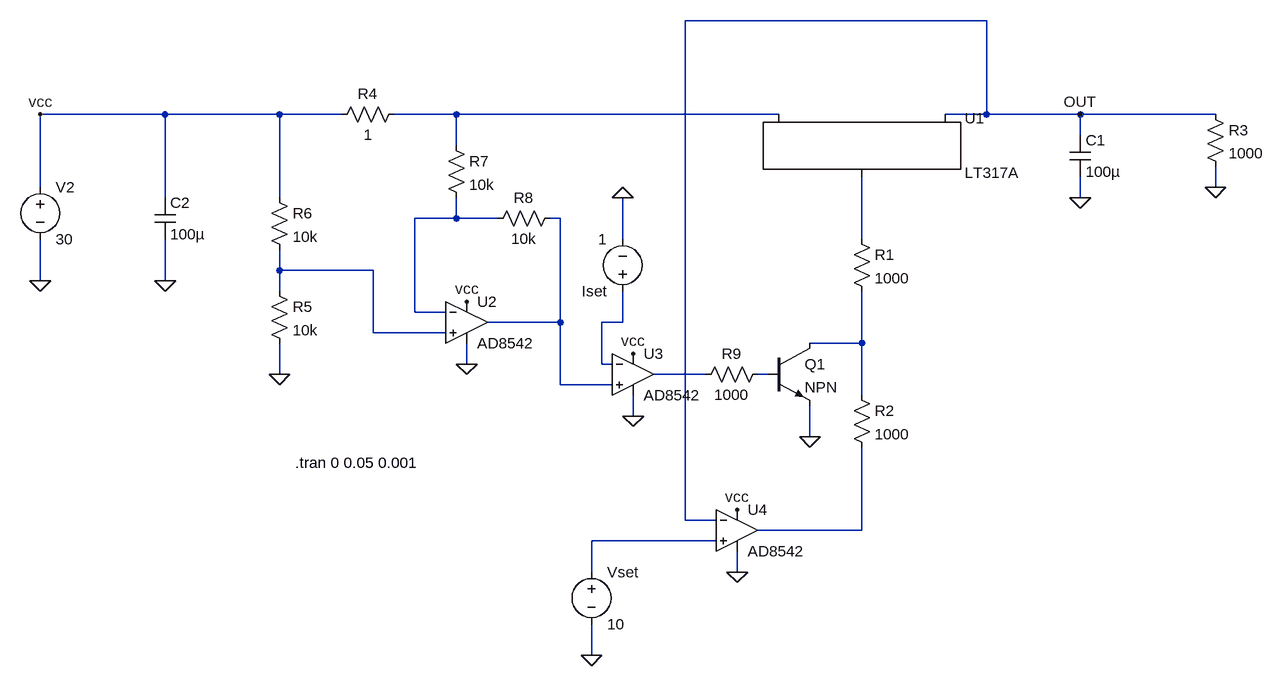
[diagram p0: schematic Draft1.asc]
Draft1.asc, the LTspice schematic file:
Version 4
SHEET 1 888 996
WIRE 416 0 -48 0
WIRE -848 144 -1040 144
WIRE -672 144 -848 144
WIRE -576 144 -672 144
WIRE -400 144 -496 144
WIRE 96 144 -400 144
WIRE 416 144 416 0
WIRE 416 144 352 144
WIRE 560 144 416 144
WIRE 768 144 560 144
WIRE 560 176 560 144
WIRE -400 192 -400 144
WIRE -1040 256 -1040 144
WIRE 768 256 768 224
WIRE -848 272 -848 144
WIRE -672 272 -672 144
WIRE 560 272 560 240
WIRE -400 304 -400 272
WIRE -400 304 -464 304
WIRE -336 304 -400 304
WIRE -240 304 -256 304
WIRE -144 336 -144 272
WIRE 224 336 224 240
WIRE -672 384 -672 352
WIRE -528 384 -672 384
WIRE -1040 400 -1040 336
WIRE -848 400 -848 336
WIRE -672 416 -672 384
WIRE -464 448 -464 304
WIRE -416 448 -464 448
WIRE -240 464 -240 304
WIRE -240 464 -352 464
WIRE -144 464 -144 416
WIRE -144 464 -176 464
WIRE -528 480 -528 384
WIRE -416 480 -528 480
WIRE 224 496 224 416
WIRE 224 496 144 496
WIRE -384 528 -384 496
WIRE -176 528 -176 464
WIRE -160 528 -176 528
WIRE -672 544 -672 496
WIRE -16 544 -96 544
WIRE 80 544 64 544
WIRE -240 560 -240 464
WIRE -160 560 -240 560
WIRE 224 576 224 496
WIRE -128 608 -128 576
WIRE 144 640 144 592
WIRE -48 768 -48 0
WIRE 0 768 -48 768
WIRE 224 784 224 656
WIRE 224 784 64 784
WIRE 0 800 -192 800
WIRE -192 848 -192 800
WIRE 32 848 32 816
WIRE -192 976 -192 928
FLAG 560 272 0
FLAG -1040 400 0
FLAG 768 256 0
FLAG 560 144 OUT
FLAG -848 400 0
FLAG -672 544 0
FLAG -1040 144 vcc
FLAG -384 432 vcc
FLAG -384 528 0
FLAG 144 640 0
FLAG -128 512 vcc
FLAG -128 608 0
FLAG 32 752 vcc
FLAG 32 848 0
FLAG -144 272 0
FLAG -192 976 0
SYMBOL cap 544 176 R0
SYMATTR InstName C1
SYMATTR Value 100µ
SYMBOL voltage -1040 240 R0
WINDOW 123 0 0 Left 0
WINDOW 39 0 0 Left 0
SYMATTR InstName V2
SYMATTR Value 30
SYMBOL res 752 128 R0
SYMATTR InstName R3
SYMATTR Value 1000
SYMBOL PowerProducts\\LT317A 224 144 R0
SYMATTR InstName U1
SYMBOL OpAmps\\AD8542 32 720 R0
SYMATTR InstName U4
SYMBOL res 208 320 R0
SYMATTR InstName R1
SYMATTR Value 1000
SYMBOL res 208 560 R0
SYMATTR InstName R2
SYMATTR Value 1000
SYMBOL res -480 128 R90
WINDOW 0 0 56 VBottom 2
WINDOW 3 32 56 VTop 2
SYMATTR InstName R4
SYMATTR Value 1
SYMBOL cap -864 272 R0
SYMATTR InstName C2
SYMATTR Value 100µ
SYMBOL OpAmps\\AD8542 -384 400 R0
SYMATTR InstName U2
SYMBOL res -688 400 R0
SYMATTR InstName R5
SYMATTR Value 10k
SYMBOL res -688 256 R0
SYMATTR InstName R6
SYMATTR Value 10k
SYMBOL res -416 176 R0
SYMATTR InstName R7
SYMATTR Value 10k
SYMBOL res -240 288 R90
WINDOW 0 0 56 VBottom 2
WINDOW 3 32 56 VTop 2
SYMATTR InstName R8
SYMATTR Value 10k
SYMBOL OpAmps\\AD8542 -128 480 R0
SYMATTR InstName U3
SYMBOL npn 80 496 R0
SYMATTR InstName Q1
SYMBOL res 80 528 R90
WINDOW 0 0 56 VBottom 2
WINDOW 3 32 56 VTop 2
SYMATTR InstName R9
SYMATTR Value 1000
SYMBOL voltage -144 432 R180
WINDOW 123 0 0 Left 0
WINDOW 39 0 0 Left 0
SYMATTR InstName Iset
SYMATTR Value 1
SYMBOL voltage -192 832 R0
WINDOW 123 0 0 Left 0
WINDOW 39 0 0 Left 0
SYMATTR InstName Vset
SYMATTR Value 10
TEXT -648 680 Left 2 !.tran 0 0.05 0.001

The netlist it stands for:
* Draft1.asc
C1 OUT 0 100µ
V2 vcc 0 30
R3 OUT 0 1000
XU1 N004 OUT N001 LT317A
XU4 N011 OUT vcc 0 N010 AD8542  ; pins In+ In- V+ V- OUT
R1 N004 N007 1000
R2 N007 N010 1000
R4 N001 vcc 1
C2 vcc 0 100µ
XU2 N005 N002 vcc 0 N003 AD8542  ; pins In+ In- V+ V- OUT
R5 N005 0 10k
R6 vcc N005 10k
R7 N001 N002 10k
R8 N003 N002 10k
XU3 N003 N006 vcc 0 N008 AD8542  ; pins In+ In- V+ V- OUT
Q1 N007 N009 0 0 NPN
R9 N009 N008 1000
V§Iset N006 0 1
Vset N011 0 10
.model NPN NPN
.model PNP PNP
.lib standard.bjt
.tran 0 0.05 0.001
.lib LTC.lib
.lib AD8542.sub
.backanno
.end